# Altium schematic sheet Power.SchDoc
size A; SheetNumber: 1; SheetTotal: 1
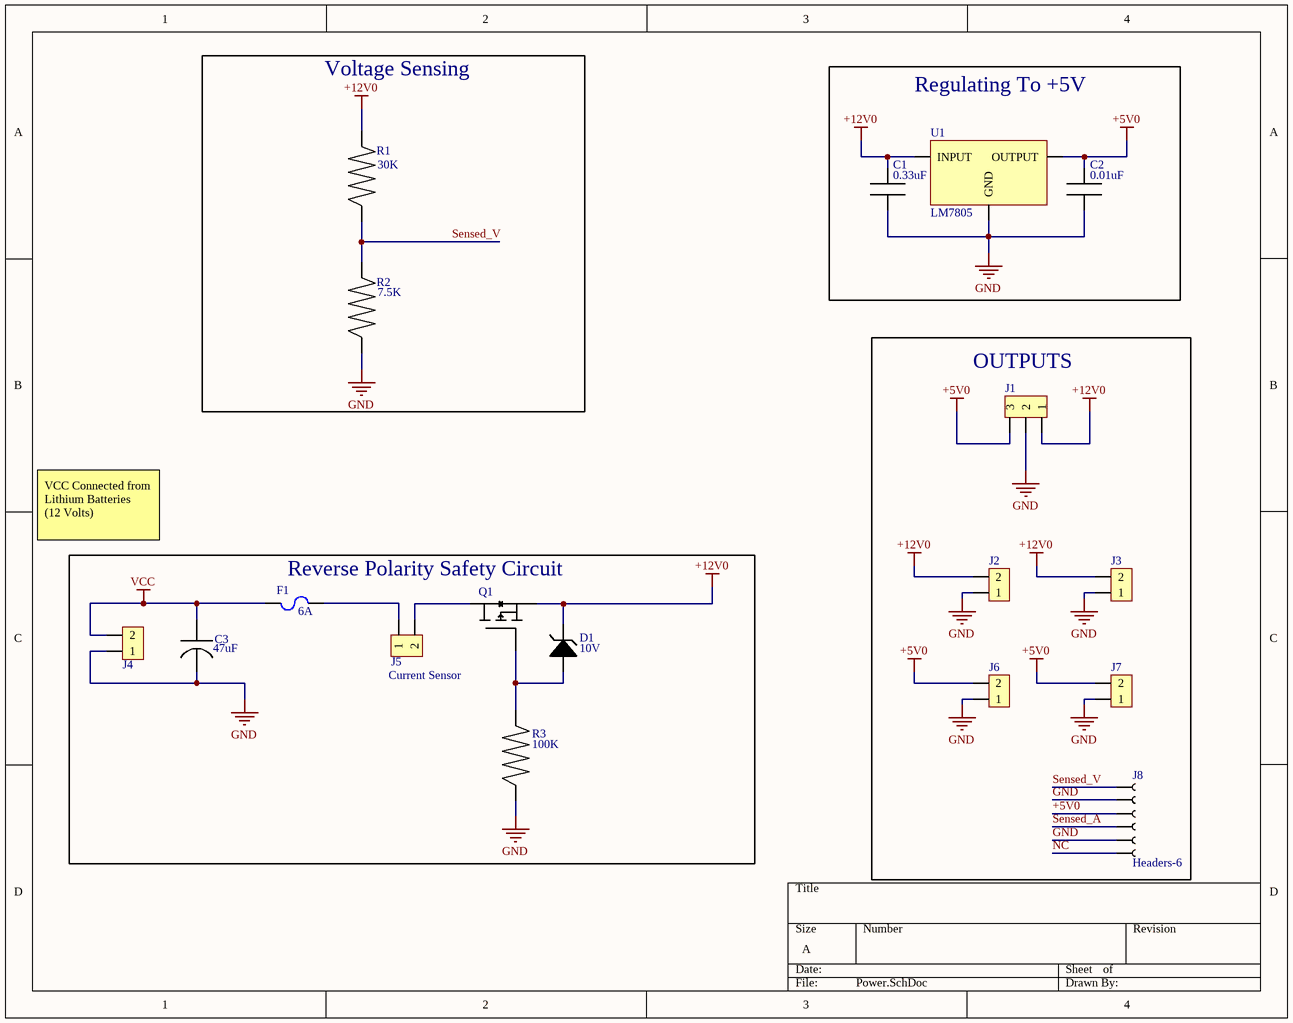
[diagram p0: Power.SchDoc]

## Parts
C1  value 0.33uF  [Ceramic Cap]  (hidden comment: Ceramic Capacitor)
C2  value 0.01uF  [Ceramic Cap]  (hidden comment: Ceramic Capacitor)
C3  value 47uF  [ALCap.]  (hidden comment: ALCapacitor)
D1  Vd: 10V  [Zener10]  (hidden comment: Zener)
F1  value 6A  [Fuse Base]  (hidden comment: Fuse)
J1  Terminal Block 3  [Terminal Block 3]  (value not drawn)
J2  Terminal Block 2-pins  [Terminal Block 2 Plugable]  (value not drawn)
J3  Terminal Block 2-pins  [Terminal Block 2 Plugable]  (value not drawn)
J4  Terminal Block 2-pins  [Terminal Block 2 Plugable]  (value not drawn)
J5  Current Sensor  [Terminal Block 2 Plugable]
J6  Terminal Block 2-pins  [Terminal Block 2 Plugable]  (value not drawn)
J7  Terminal Block 2-pins  [Terminal Block 2 Plugable]  (value not drawn)
J8  Headers-6  [Headers 6-pins]
Q1  MOSFET  [IRF9540]  (value not drawn)
R1  value 30K  [resistor]  (hidden comment: Resistor)
R2  value 7.5K  [resistor]  (hidden comment: Resistor)
R3  value 100K  [resistor]  (hidden comment: Resistor)
U1  LM7805  [LM7805]

## Blocks framed on the sheet
Voltage Sensing: R1 R2
Regulating To +5V: C1 C2 U1
OUTPUTS: J1-J3 J6-J8
Reverse Polarity Safety Circuit: C3 D1 F1 J4 J5 Q1 R3

## Nets
+5V0: C2.2 J1.3 J6.2 J7.2 J8.4 U1.3(OUTPUT)
+12V0: C1.2 D1.2(Cath) J1.1 J2.2 J3.2 Q1.S(Source) R1.2 U1.1(INPUT)
GND: C1.1 C2.1 C3.2 J1.2 J2.1 J3.1 J4.1 J6.1 J7.1 J8.2 J8.5 R2.1 R3.1 U1.2(GND)
VCC: C3.1 F1.1 J4.2
NC: J8.1
Sensed_A: J8.3
Sensed_V: J8.6 R1.1 R2.2
NetD1_1: D1.1(anode) Q1.G(Gate) R3.2
NetF1_2: F1.2 J5.1
NetJ5_2: J5.2 Q1.D(Drain)

## Notes on the sheet
- VCC Connected from Lithium Batteries
  (12 Volts)

## Library data of the parts
J2-J7 = Terminal Block 2-pins: PN: 1935161; MF: Phoenix Contact; Supplier: Digikey; Supplier PN: 277-1667-ND
Q1 = MOSFET: P-Channel; PN: IRF9540N; MF: *; Supplier: Makers; Supplier PN: 14721190833f; ComponentLink1Description: link; ComponentLink1URL: https://makerselectronics.com/product/irf9540
U1 = LM7805: PN: LM7805; Supplier: Makers; ComponentLink1Description: link; ComponentLink1URL: https://makerselectronics.com/product/regelator-7805